# Altium schematic sheet NC7SZ04P5X_2021-01-09.schdoc
size 49 x 32 mm
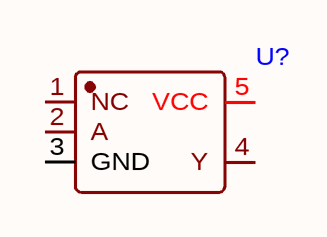
[diagram p0: NC7SZ04P5X_2021-01-09.schdoc]

## Parts
U?  (no value)  [SC-70-5_L2.1-W1.3-P0.65-LS2.1-BR]

## Nets

Not connected (* = marked no-connect by the designer): U? 1(NC) 2(A) 3(GND) 4(Y) 5(VCC)

## Library data of the parts
U? = NC7SZ04P5X